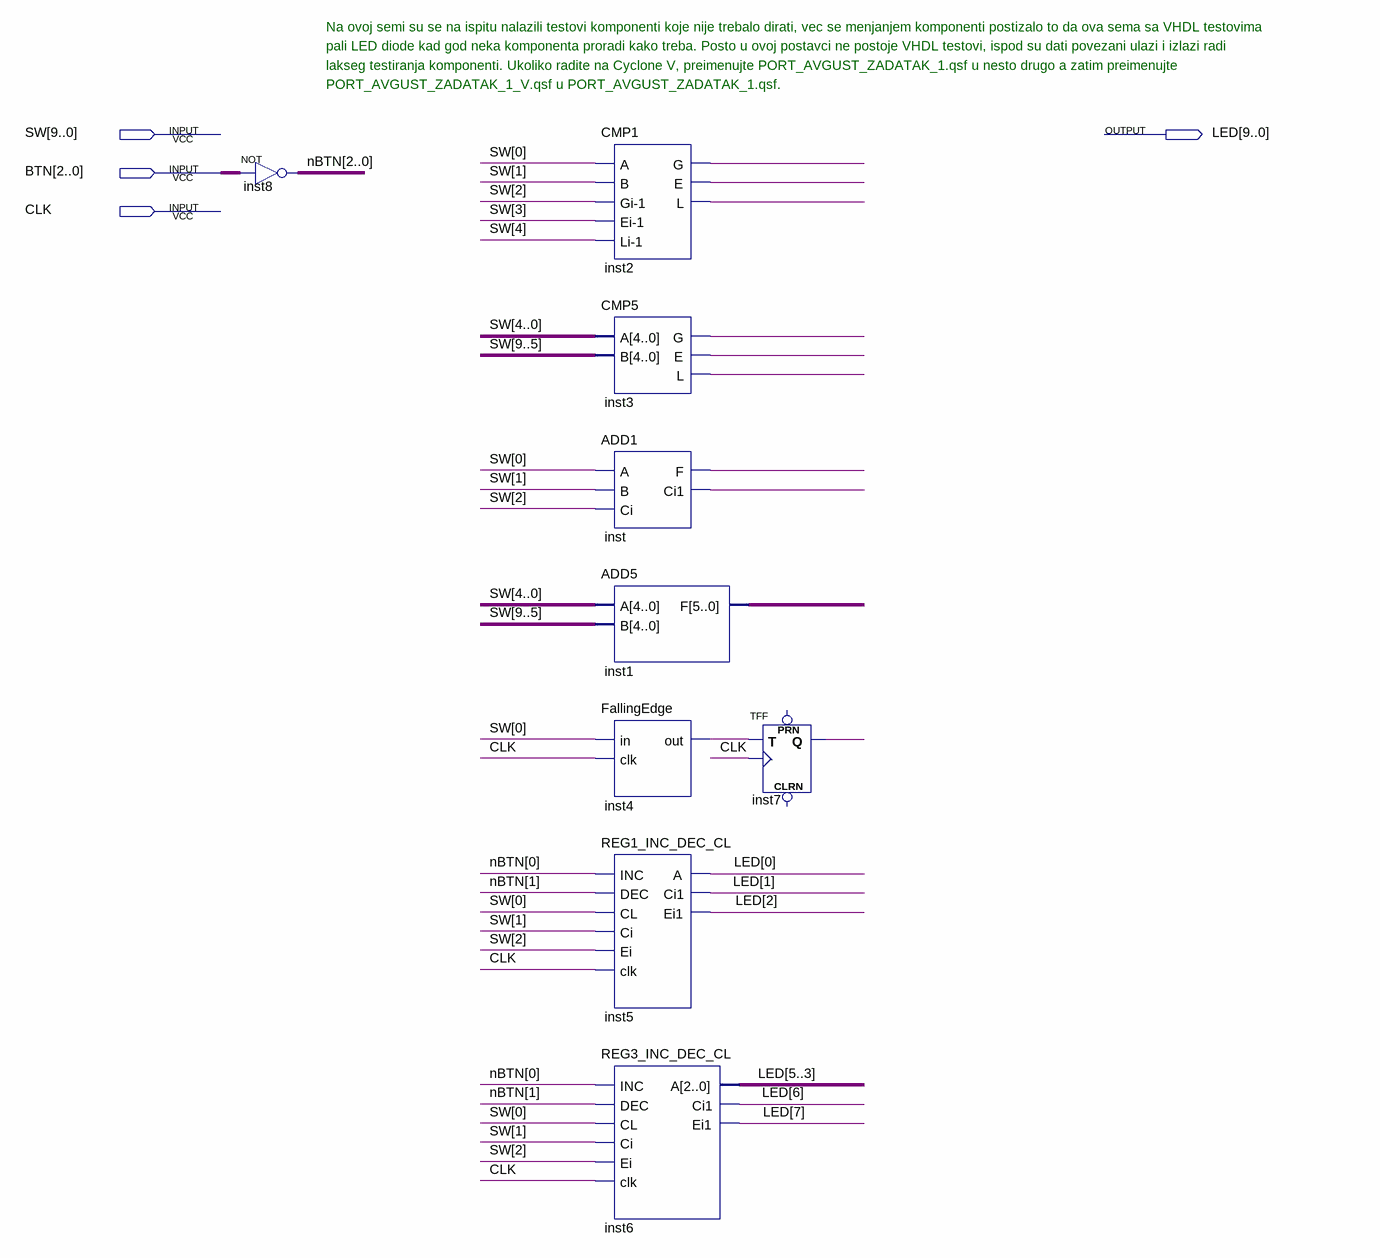
[diagram p0: schematic sheet]
// Quartus schematic PORT_AVGUST_2020_ZADATAK_1.bdf as structural Verilog: 9 symbols, 4 pins
module PORT_AVGUST_2020_ZADATAK_1 (
  input  [9:0] SW,
  input  [2:0] BTN,
  input  CLK,
  output [9:0] LED
);

  wire inst2_e, inst2_g, inst2_l, inst3_e, inst3_g, inst3_l, inst4_out, inst7_q, inst_ci1, inst_f;
  wire [2:0] nBTN;
  wire [5:0] inst1_f;

  assign nBTN = ~BTN;  // NOT inst8, 3 bits wide
  CMP1 inst2 (
    .A(SW[0]), .B(SW[1]), .\Gi-1 (SW[2]), .\Ei-1 (SW[3]), .\Li-1 (SW[4]), .G(inst2_g), .E(inst2_e),
    .L(inst2_l));
  CMP5 inst3 (.A(SW[4:0]), .B(SW[9:5]), .G(inst3_g), .E(inst3_e), .L(inst3_l));
  ADD1 inst (.A(SW[0]), .B(SW[1]), .Ci(SW[2]), .F(inst_f), .Ci1(inst_ci1));
  ADD5 inst1 (.A(SW[4:0]), .B(SW[9:5]), .F(inst1_f));
  FallingEdge inst4 (.in(SW[0]), .clk(CLK), .out(inst4_out));
  REG1_INC_DEC_CL inst5 (
    .INC(nBTN[0]), .DEC(nBTN[1]), .CL(SW[0]), .Ci(SW[1]), .Ei(SW[2]), .clk(CLK), .A(LED[0]), .Ci1(LED[1]),
    .Ei1(LED[2]));
  REG3_INC_DEC_CL inst6 (
    .INC(nBTN[0]), .DEC(nBTN[1]), .CL(SW[0]), .Ci(SW[1]), .Ei(SW[2]), .clk(CLK), .A(LED[5:3]), .Ci1(LED[6]),
    .Ei1(LED[7]));
  TFF inst7 (.T(inst4_out), .CLK(CLK), .Q(inst7_q));  // open: PRN, CLRN

  // Notes on the sheet:
  //   Na ovoj semi su se na ispitu nalazili testovi komponenti koje nije trebalo dirati, vec se menjanjem komponenti postizalo to da ova sema sa VHDL testovima
  //   pali LED diode kad god neka komponenta proradi kako treba. Posto u ovoj postavci ne postoje VHDL testovi, ispod su dati povezani ulazi i izlazi radi
  //   lakseg testiranja komponenti. Ukoliko radite na Cyclone V, preimenujte PORT_AVGUST_ZADATAK_1.qsf u nesto drugo a zatim preimenujte
  //   PORT_AVGUST_ZADATAK_1_V.qsf u PORT_AVGUST_ZADATAK_1.qsf.
endmodule
